# Altium project linobyte-charDisplay.PrjPCB
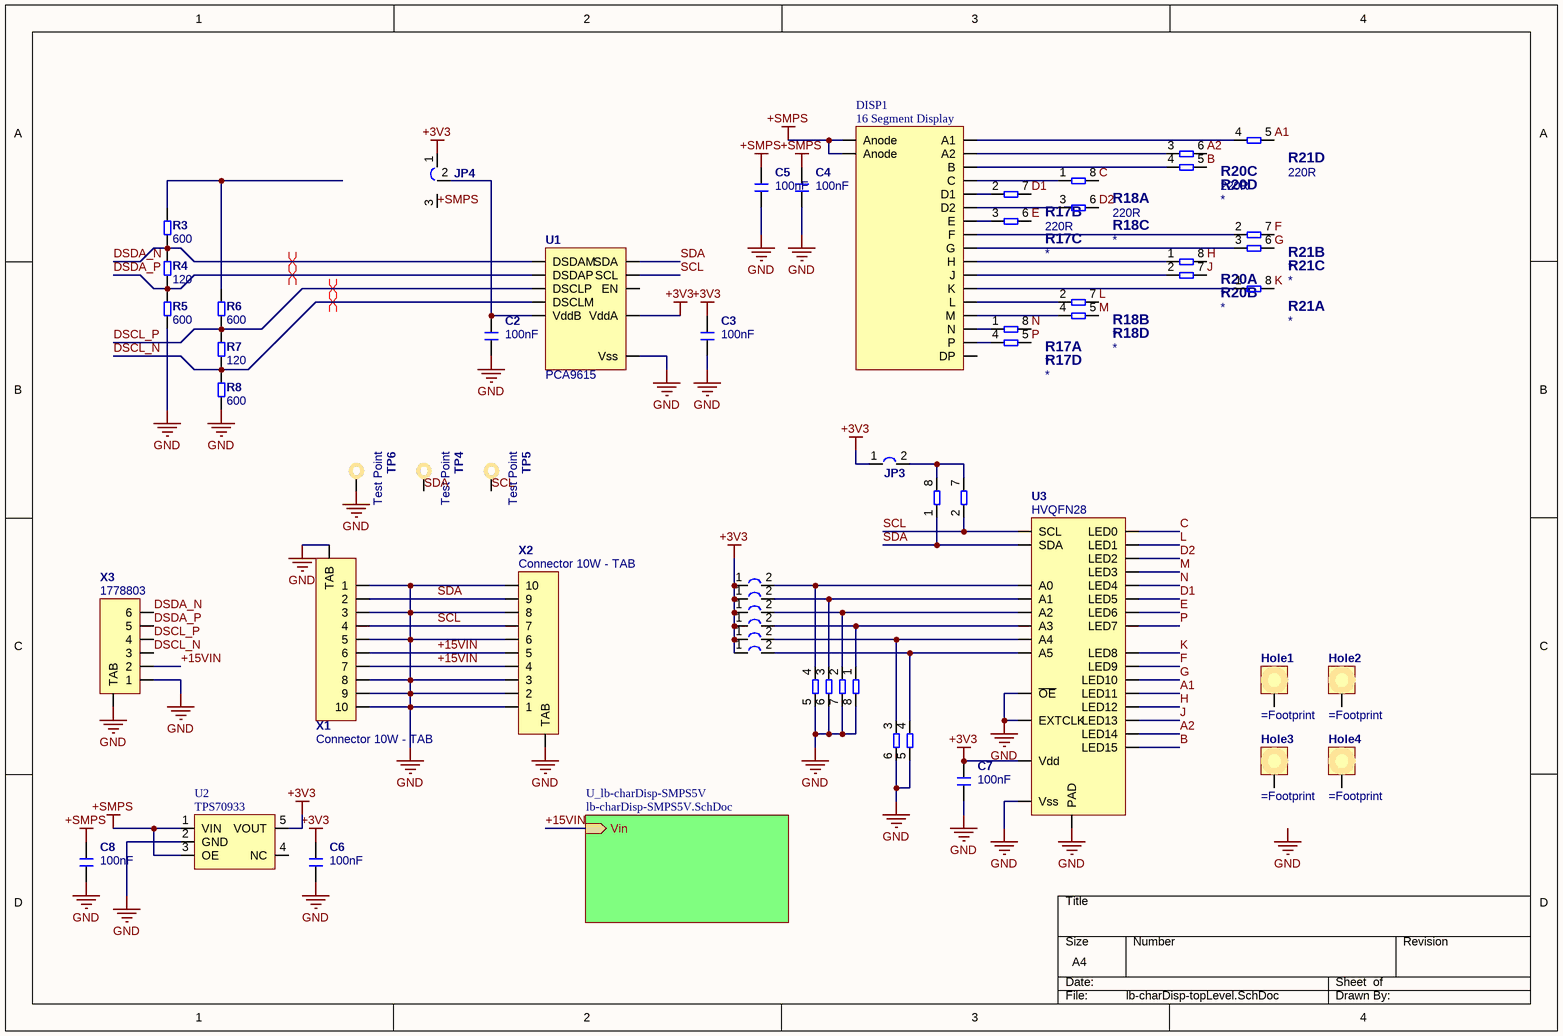
[diagram p0: lb-charDisp-topLevel.SchDoc]
2 sheets, 57 parts. Net scope: hierarchical (ports join the sheet entries above them; power ports are global).
Board file: lb-charDisplay-PCB1.PcbDoc
Sheets:
  lb-charDisp-topLevel.SchDoc
    U_lb-charDisp-SMPS5V = lb-charDisp-SMPS5V.SchDoc

## Sheet lb-charDisp-topLevel.SchDoc
size A4

### Parts
C2  100nF  [C0603_N]
C3  100nF  [C0603_N]
C4  100nF  [C0603_N]
C5  100nF  [C0603_N]
C6  100nF  [C0603_N]
C7  100nF  [C0603_N]
C8  100nF  [C0603_N]
DISP1  16 Segment Display  [PSA23-11SRWA]
Hole1  (no value)  [Insert-Thread-SMD-M2]
Hole2  (no value)  [Insert-Thread-SMD-M2]
Hole3  (no value)  [Insert-Thread-SMD-M2]
Hole4  (no value)  [Insert-Thread-SMD-M2]
JP3  Jumper 2W  [Jumper SMD 2W NO]  (value not drawn)
JP4  Jumper 3W  [Jumper SMD 3W NO]  (value not drawn)
JP_A0  Jumper 2W  [Jumper SMD 2W NO]  (value not drawn)
JP_A1  Jumper 2W  [Jumper SMD 2W NO]  (value not drawn)
JP_A2  Jumper 2W  [Jumper SMD 2W NO]  (value not drawn)
JP_A3  Jumper 2W  [Jumper SMD 2W NO]  (value not drawn)
JP_A4  Jumper 2W  [Jumper SMD 2W NO]  (value not drawn)
JP_A5  Jumper 2W  [Jumper SMD 2W NO]  (value not drawn)
R1  (no value)  [YC164]  (parts A,B,C,D of 4)
R2  (no value)  [YC164]  (parts A,B,C,D of 4)
R3  600  [R0603]
R4  120  [R0603]
R5  600  [R0603]
R6  600  [R0603]
R7  120  [R0603]
R8  600  [R0603]
R17  Resistor Array - 4P  [YC164]  (value not drawn)  (parts A,B,C,D of 4)
R18  value 220R  [YC164]  (hidden comment: Resistor Array - 4P)  (parts A,B,C,D of 4)
R20  Resistor Array - 4P  [YC164]  (value not drawn)  (parts A,B,C,D of 4)
R21  Resistor Array - 4P  [YC164]  (value not drawn)  (parts A,B,C,D of 4)
TP4  Test Point  [TestPoint-1.2mm]
TP5  Test Point  [TestPoint-1.2mm]
TP6  Test Point  [TestPoint-1.2mm]
U1  PCA9615  [TSSOP10]
U2  TPS70933  [SOT23-5_N]
U3  HVQFN28  [QFN28]
X1  Connector 10W - TAB  [FPC Conn. 10W 1-84953-0]
X2  Connector 10W - TAB  [FPC Conn. 10W 1-84953-0]
X3  1778803  [PTSM-6W-H-SMD]

### Sub-sheets
U_lb-charDisp-SMPS5V = lb-charDisp-SMPS5V.SchDoc: Vin (in)

### Nets
+3V3: C3.1 C6.1 C7.1 JP3.1 JP4.1 JP_A0.1 JP_A1.1 JP_A2.1 JP_A3.1 JP_A4.1 JP_A5.1 U1.1(VddA) U2.5(VOUT) U3.25(Vdd)
+SMPS: C4.1 C5.1 C8.1 DISP1.1(Anode) DISP1.11(Anode) JP4.3 U2.1(VIN) U2.3(OE)
GND: C2.2 C3.2 C4.2 C5.2 C6.2 C7.2 C8.2 R1.5 R1.6 R1.7 R1.8 R2.5 R2.6 R5.1 R8.1 TP6.1 U1.5(Vss) U2.2(GND) U3.11(Vss) U3.20(~{OE}) U3.22(EXTCLK) U3.PAD X1.1 X1.3 X1.5 X1.8 X1.9 X1.10 X1.TAB X2.1 X2.2 X2.3 X2.6 X2.8 X2.10 X2.TAB X3.1 X3.TAB
+15VIN: X1.6 X1.7 X2.4 X2.5 X3.2 ; sheet U_lb-charDisp-SMPS5V/Vin
A1: R21.5 U3.15(LED11)
A2: R20.6 U3.18(LED14)
B: R20.5 U3.19(LED15)
C: R18.8 U3.3(LED0)
D1: R17.7 U3.8(LED5)
D2: R18.6 U3.5(LED2)
DSCL_N: R7.1 R8.2 U1.6(DSCLM) X3.3
DSCL_P: R6.1 R7.2 U1.7(DSCLP) X3.4
DSDA_N: R3.1 R4.2 U1.9(DSDAM) X3.6
DSDA_P: R4.1 R5.2 U1.8(DSDAP) X3.5
E: R17.6 U3.9(LED6)
F: R21.7 U3.13(LED9)
G: R21.6 U3.14(LED10)
H: R20.8 U3.16(LED12)
J: R20.7 U3.17(LED13)
K: R21.8 U3.12(LED8)
L: R18.7 U3.4(LED1)
M: R18.5 U3.6(LED3)
N: R17.8 U3.7(LED4)
P: R17.5 U3.10(LED7)
SCL: R2.2 TP5.1 U1.4(SCL) U3.23(SCL) X1.4 X2.7
SDA: R2.1 TP4.1 U1.2(SDA) U3.24(SDA) X1.2 X2.9
NetC2_1: C2.1 JP4.2 U1.10(VddB)
NetDISP1_2: DISP1.2(P) R17.4
NetDISP1_3: DISP1.3(E) R17.3
NetDISP1_4: DISP1.4(D1) R17.2
NetDISP1_5: DISP1.5(N) R17.1
NetDISP1_6: DISP1.6(M) R18.4
NetDISP1_7: DISP1.7(D2) R18.3
NetDISP1_8: DISP1.8(L) R18.2
NetDISP1_9: DISP1.9(C) R18.1
NetDISP1_12: DISP1.12(K) R21.1
NetDISP1_13: DISP1.13(B) R20.4
NetDISP1_14: DISP1.14(A2) R20.3
NetDISP1_15: DISP1.15(J) R20.2
NetDISP1_16: DISP1.16(H) R20.1
NetDISP1_17: DISP1.17(A1) R21.4
NetDISP1_18: DISP1.18(G) R21.3
NetDISP1_19: DISP1.19(F) R21.2
NetJP3_2: JP3.2 R2.7 R2.8
NetJP_A0_2: JP_A0.2 R1.4 U3.26(A0)
NetJP_A1_2: JP_A1.2 R1.3 U3.27(A1)
NetJP_A2_2: JP_A2.2 R1.2 U3.28(A2)
NetJP_A3_2: JP_A3.2 R1.1 U3.1(A3)
NetJP_A4_2: JP_A4.2 R2.3 U3.2(A4)
NetJP_A5_2: JP_A5.2 R2.4 U3.21(A5)
NetR3_2: R3.2 R6.2

Not connected (* = marked no-connect by the designer): DISP1 10(DP); Hole1 1; Hole2 1; Hole3 1; Hole4 1; U1 3(EN); U2 4(NC)

### Layout directives
differential pair: DSCL_N, DSCL_P, DSDA_N, DSDA_P

### Notes on the sheet
- Labels drawn without touching a wire or pin: GND

### Library data of the parts
C2-C8 = Capacitor: Capacitor MLCC; Manufacturer: Yageo; Manufacturer Part Number: CC0603KRX7R9BB104; Tolerance (%): 10; Category: Capacitor; Package: 0603; Value: 100nF; Supplier Part Number 1: 1362556; Supplier 1: Farnell; ComponentLink1URL: http://www.yageo.com; ComponentLink1Description: Manufacturer Website; Voltage Rating (Volts): *; Supplier 2: Digi-Key; Supplier Part Number 2: 311-1344-1-ND
DISP1 = Display 16 Segment
Hole1-Hole4 = Hole: Footprint: =Footprint
R1 R2 = Resistor Array - 4P: Value: 4k7
R3-R8 = Resistor: Published: 17-Dec-2003; LatestRevisionDate: 19-Mar-2004; LatestRevisionNote: Silkscreen size reduced.; PackageDocument: Mar-2003; PackageReference: 3-0603; Publisher: Altium Limited; Code_IPC: 1608 [0603]; ComponentLink1Description: Manufacturer Link; ComponentLink1URL: http://www.panasonic.com/industrial/components/resistive_products.htm; ComponentLink2Description: Datasheet; ComponentLink2URL: http://www.panasonic.com/industrial/components/pdf/AOA0000CE2.pdf
  R3 R5 R6 R8: Value: 600
  R4 R7: Value: 120
U1 = PCA9615DP
U2 = XC6222
U3 = PCA9685
X3 = Connector 6W - TAB
R17 R18 R20 R21 = Resistor Array - 4P
  R17 R20 R21: Value: *

## Sheet lb-charDisp-SMPS5V.SchDoc
size A4
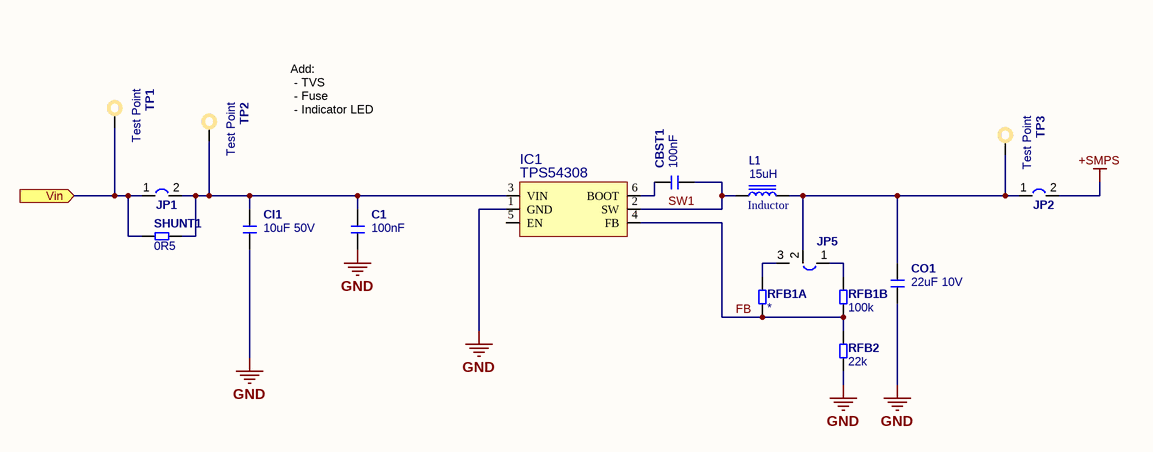
[diagram p1: lb-charDisp-SMPS5V.SchDoc]

### Parts
C1  100nF  [C0603_N]
CBST1  100nF  [C0603_N]
CI1  10uF 50V  [C1210_N]
CO1  22uF 10V  [C1210_N]
IC1  TPS54308  [SOT23]
JP1  Jumper 2W  [Jumper SMD 2W NO]  (value not drawn)
JP2  Jumper 2W  [Jumper SMD 2W NO]  (value not drawn)
JP5  Jumper 3W  [Jumper SMD 3W NO]  (value not drawn)
L1  Inductor  value 15uH  [Inductor 4mm]
RFB1A  *  [R0603]
RFB1B  100k  [R0603]
RFB2  22k  [R0603]
SHUNT1  0R5  [R0603]
TP1  Test Point  [TestPoint-1.2mm]
TP2  Test Point  [TestPoint-1.2mm]
TP3  Test Point  [TestPoint-1.2mm]

### Ports
Vin (in)

### Nets
+SMPS: JP2.2
GND: C1.2 CI1.2 CO1.2 IC1.1(GND) RFB2.1
+15VIN: JP1.1 SHUNT1.1 TP1.1 ; port Vin
FB: IC1.4(FB) RFB1A.1 RFB1B.1 RFB2.2
SW1: CBST1.2 IC1.2(SW) L1.1
NetC1_1: C1.1 CI1.1 IC1.3(VIN) JP1.2 SHUNT1.2 TP2.1
NetCBST1_1: CBST1.1 IC1.6(BOOT)
NetCO1_1: CO1.1 JP2.1 JP5.2 L1.2 TP3.1
NetJP5_1: JP5.1 RFB1B.2
NetJP5_3: JP5.3 RFB1A.2

Not connected (* = marked no-connect by the designer): IC1 5(EN)

### Notes on the sheet
- Add:
  - TVS
  - Fuse
  - Indicator LED

### Library data of the parts
C1 CBST1 CI1 CO1 = Capacitor: as C2 on sheet lb-charDisp-topLevel; Category: Capacitor; Package: 0603; Supplier Part Number 1: 1362556; Supplier 1: Farnell; ComponentLink1URL: http://www.yageo.com; ComponentLink1Description: Manufacturer Website; Voltage Rating (Volts): *; Supplier 2: Digi-Key; Supplier Part Number 2: 311-1344-1-ND
  C1 CBST1: Value: 100nF
  CI1: Value: 10uF 50V
  CO1: Value: 22uF 10V
IC1 = TPS54308: Buck Converter
RFB1A RFB1B RFB2 SHUNT1 = Resistor: Published: 17-Dec-2003; LatestRevisionDate: 19-Mar-2004; LatestRevisionNote: Silkscreen size reduced.; PackageDocument: Mar-2003; PackageReference: 3-0603; Publisher: Altium Limited; Code_IPC: 1608 [0603]; ComponentLink1Description: Manufacturer Link; ComponentLink1URL: http://www.panasonic.com/industrial/components/resistive_products.htm; ComponentLink2Description: Datasheet; ComponentLink2URL: http://www.panasonic.com/industrial/components/pdf/AOA0000CE2.pdf
  RFB1A: Value: *
  RFB1B: Value: 100k
  RFB2: Value: 22k
  SHUNT1: Value: 0R5

## Nets that join several sheets
+SMPS: lb-charDisp-topLevel (8 pins), lb-charDisp-SMPS5V (JP2.2)
GND: lb-charDisp-topLevel (38 pins), lb-charDisp-SMPS5V (5 pins)
+15VIN: lb-charDisp-topLevel (5 pins), lb-charDisp-SMPS5V (JP1.1 SHUNT1.1 TP1.1)